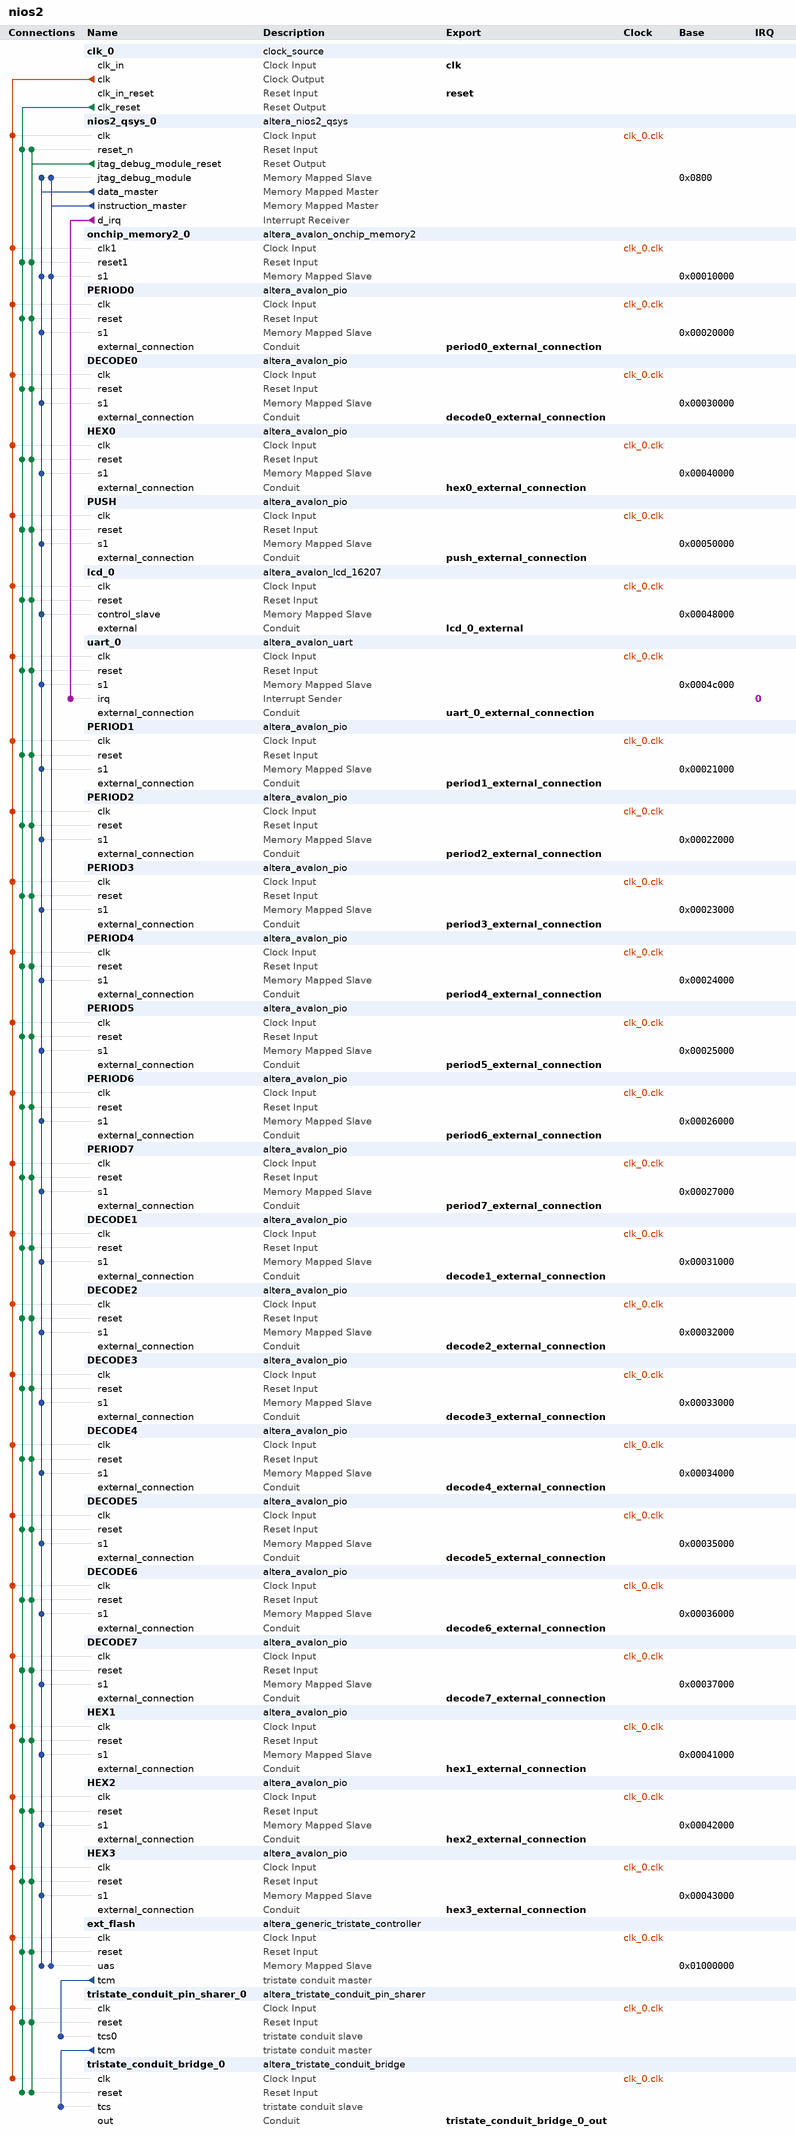
[diagram p0: system contents]
# Platform Designer (Qsys) system nios2, Cyclone II EP2C35F672C6
# Parameters at their usual value, and those the tool derives, are not listed.
package require -exact qsys 13.0.1.99.2
create_system nios2
set_project_property DEVICE_FAMILY {Cyclone II}
set_project_property DEVICE EP2C35F672C6

add_instance clk_0 clock_source 13.0
set_instance_parameter_value clk_0 clockFrequency 50000000

add_instance nios2_qsys_0 altera_nios2_qsys 13.0
set_instance_parameter_value nios2_qsys_0 resetSlave onchip_memory2_0.s1
set_instance_parameter_value nios2_qsys_0 mmu_TLBMissExcSlave None
set_instance_parameter_value nios2_qsys_0 exceptionSlave onchip_memory2_0.s1
set_instance_parameter_value nios2_qsys_0 breakSlave nios2_qsys_0.jtag_debug_module
set_instance_parameter_value nios2_qsys_0 impl Tiny
set_instance_parameter_value nios2_qsys_0 icache_size 4096

add_instance onchip_memory2_0 altera_avalon_onchip_memory2 13.0.1.99.2
set_instance_parameter_value onchip_memory2_0 dataWidth 32
set_instance_parameter_value onchip_memory2_0 dualPort false
set_instance_parameter_value onchip_memory2_0 initMemContent true
set_instance_parameter_value onchip_memory2_0 initializationFileName onchip_mem.hex
set_instance_parameter_value onchip_memory2_0 memorySize 16384

add_instance PERIOD0 altera_avalon_pio 13.0.1.99.2
set_instance_parameter_value PERIOD0 direction Output
set_instance_parameter_value PERIOD0 width 28

add_instance DECODE0 altera_avalon_pio 13.0.1.99.2
set_instance_parameter_value DECODE0 direction Output
set_instance_parameter_value DECODE0 width 28

add_instance HEX0 altera_avalon_pio 13.0.1.99.2
set_instance_parameter_value HEX0 direction Output
set_instance_parameter_value HEX0 width 8

add_instance PUSH altera_avalon_pio 13.0.1.99.2
set_instance_parameter_value PUSH direction Input
set_instance_parameter_value PUSH width 2

add_instance lcd_0 altera_avalon_lcd_16207 13.0.1.99.2

add_instance uart_0 altera_avalon_uart 13.0.1.99.2
set_instance_parameter_value uart_0 baud 115200
set_instance_parameter_value uart_0 dataBits 8
set_instance_parameter_value uart_0 fixedBaud true
set_instance_parameter_value uart_0 parity NONE
set_instance_parameter_value uart_0 stopBits 1

add_instance PERIOD1 altera_avalon_pio 13.0.1.99.2
set_instance_parameter_value PERIOD1 direction Output
set_instance_parameter_value PERIOD1 width 28

add_instance PERIOD2 altera_avalon_pio 13.0.1.99.2
set_instance_parameter_value PERIOD2 direction Output
set_instance_parameter_value PERIOD2 width 28

add_instance PERIOD3 altera_avalon_pio 13.0.1.99.2
set_instance_parameter_value PERIOD3 direction Output
set_instance_parameter_value PERIOD3 width 28

add_instance PERIOD4 altera_avalon_pio 13.0.1.99.2
set_instance_parameter_value PERIOD4 direction Output
set_instance_parameter_value PERIOD4 width 28

add_instance PERIOD5 altera_avalon_pio 13.0.1.99.2
set_instance_parameter_value PERIOD5 direction Output
set_instance_parameter_value PERIOD5 width 28

add_instance PERIOD6 altera_avalon_pio 13.0.1.99.2
set_instance_parameter_value PERIOD6 direction Output
set_instance_parameter_value PERIOD6 width 28

add_instance PERIOD7 altera_avalon_pio 13.0.1.99.2
set_instance_parameter_value PERIOD7 direction Output
set_instance_parameter_value PERIOD7 width 28

add_instance DECODE1 altera_avalon_pio 13.0.1.99.2
set_instance_parameter_value DECODE1 direction Output
set_instance_parameter_value DECODE1 width 28

add_instance DECODE2 altera_avalon_pio 13.0.1.99.2
set_instance_parameter_value DECODE2 direction Output
set_instance_parameter_value DECODE2 width 28

add_instance DECODE3 altera_avalon_pio 13.0.1.99.2
set_instance_parameter_value DECODE3 direction Output
set_instance_parameter_value DECODE3 width 28

add_instance DECODE4 altera_avalon_pio 13.0.1.99.2
set_instance_parameter_value DECODE4 direction Output
set_instance_parameter_value DECODE4 width 28

add_instance DECODE5 altera_avalon_pio 13.0.1.99.2
set_instance_parameter_value DECODE5 direction Output
set_instance_parameter_value DECODE5 width 28

add_instance DECODE6 altera_avalon_pio 13.0.1.99.2
set_instance_parameter_value DECODE6 direction Output
set_instance_parameter_value DECODE6 width 28

add_instance DECODE7 altera_avalon_pio 13.0.1.99.2
set_instance_parameter_value DECODE7 direction Output
set_instance_parameter_value DECODE7 width 28

add_instance HEX1 altera_avalon_pio 13.0.1.99.2
set_instance_parameter_value HEX1 direction Output
set_instance_parameter_value HEX1 width 8

add_instance HEX2 altera_avalon_pio 13.0.1.99.2
set_instance_parameter_value HEX2 direction Output
set_instance_parameter_value HEX2 width 8

add_instance HEX3 altera_avalon_pio 13.0.1.99.2
set_instance_parameter_value HEX3 direction Output
set_instance_parameter_value HEX3 width 8

add_instance ext_flash altera_generic_tristate_controller 13.0
set_instance_parameter_value ext_flash TCM_ADDRESS_W 22
set_instance_parameter_value ext_flash TCM_DATA_W 8
set_instance_parameter_value ext_flash TCM_BYTEENABLE_W 1
set_instance_parameter_value ext_flash TCM_READ_WAIT 100
set_instance_parameter_value ext_flash TCM_WRITE_WAIT 100
set_instance_parameter_value ext_flash TCM_SETUP_WAIT 50
set_instance_parameter_value ext_flash TCM_DATA_HOLD 50
set_instance_parameter_value ext_flash TCM_MAX_PENDING_READ_TRANSACTIONS 3
set_instance_parameter_value ext_flash TCM_TURNAROUND_TIME 2
set_instance_parameter_value ext_flash TCM_TIMING_UNITS 0
set_instance_parameter_value ext_flash TCM_READLATENCY 2
set_instance_parameter_value ext_flash TCM_SYMBOLS_PER_WORD 1
set_instance_parameter_value ext_flash USE_READ 1
set_instance_parameter_value ext_flash USE_BEGINTRANSFER 0
set_instance_parameter_value ext_flash USE_BYTEENABLE 0
set_instance_parameter_value ext_flash USE_OUTPUTENABLE 0
set_instance_parameter_value ext_flash ACTIVE_LOW_READ 1
set_instance_parameter_value ext_flash ACTIVE_LOW_BYTEENABLE 0
set_instance_parameter_value ext_flash ACTIVE_LOW_OUTPUTENABLE 0
set_instance_parameter_value ext_flash ACTIVE_LOW_BEGINTRANSFER 0
set_instance_parameter_value ext_flash CHIPSELECT_THROUGH_READLATENCY 0
set_instance_parameter_value ext_flash MODULE_ASSIGNMENT_KEYS embeddedsw.configuration.hwClassnameDriverSupportList,embeddedsw.configuration.hwClassnameDriverSupportDefault,embeddedsw.CMacro.SETUP_VALUE,embeddedsw.CMacro.WAIT_VALUE,embeddedsw.CMacro.HOLD_VALUE,embeddedsw.CMacro.TIMING_UNITS,embeddedsw.CMacro.SIZE,embeddedsw.memoryInfo.MEM_INIT_DATA_WIDTH,embeddedsw.memoryInfo.HAS_BYTE_LANE,embeddedsw.memoryInfo.IS_FLASH,embeddedsw.memoryInfo.GENERATE_DAT_SYM,embeddedsw.memoryInfo.GENERATE_FLASH,embeddedsw.memoryInfo.DAT_SYM_INSTALL_DIR,embeddedsw.memoryInfo.FLASH_INSTALL_DIR
set_instance_parameter_value ext_flash MODULE_ASSIGNMENT_VALUES altera_avalon_lan91c111:altera_avalon_cfi_flash,altera_avalon_cfi_flash,0,0,0,ns,262144u,8,0,1,1,1,SIM_DIR,APP_DIR
set_instance_parameter_value ext_flash INTERFACE_ASSIGNMENT_KEYS embeddedsw.configuration.isFlash,embeddedsw.configuration.isMemoryDevice,embeddedsw.configuration.isNonVolatileStorage
set_instance_parameter_value ext_flash INTERFACE_ASSIGNMENT_VALUES 1,1,1

add_instance tristate_conduit_pin_sharer_0 altera_tristate_conduit_pin_sharer 13.0
set_instance_parameter_value tristate_conduit_pin_sharer_0 NUM_INTERFACES 1

add_instance tristate_conduit_bridge_0 altera_tristate_conduit_bridge 13.0

# connections
add_connection clk_0.clk DECODE0.clk clock
add_connection clk_0.clk DECODE1.clk clock
add_connection clk_0.clk DECODE2.clk clock
add_connection clk_0.clk DECODE3.clk clock
add_connection clk_0.clk DECODE4.clk clock
add_connection clk_0.clk DECODE5.clk clock
add_connection clk_0.clk DECODE6.clk clock
add_connection clk_0.clk DECODE7.clk clock
add_connection clk_0.clk ext_flash.clk clock
add_connection clk_0.clk HEX0.clk clock
add_connection clk_0.clk HEX1.clk clock
add_connection clk_0.clk HEX2.clk clock
add_connection clk_0.clk HEX3.clk clock
add_connection clk_0.clk lcd_0.clk clock
add_connection clk_0.clk nios2_qsys_0.clk clock
add_connection clk_0.clk onchip_memory2_0.clk1 clock
add_connection clk_0.clk PERIOD0.clk clock
add_connection clk_0.clk PERIOD1.clk clock
add_connection clk_0.clk PERIOD2.clk clock
add_connection clk_0.clk PERIOD3.clk clock
add_connection clk_0.clk PERIOD4.clk clock
add_connection clk_0.clk PERIOD5.clk clock
add_connection clk_0.clk PERIOD6.clk clock
add_connection clk_0.clk PERIOD7.clk clock
add_connection clk_0.clk PUSH.clk clock
add_connection clk_0.clk tristate_conduit_bridge_0.clk clock
add_connection clk_0.clk tristate_conduit_pin_sharer_0.clk clock
add_connection clk_0.clk uart_0.clk clock
add_connection clk_0.clk_reset DECODE0.reset reset
add_connection clk_0.clk_reset DECODE1.reset reset
add_connection clk_0.clk_reset DECODE2.reset reset
add_connection clk_0.clk_reset DECODE3.reset reset
add_connection clk_0.clk_reset DECODE4.reset reset
add_connection clk_0.clk_reset DECODE5.reset reset
add_connection clk_0.clk_reset DECODE6.reset reset
add_connection clk_0.clk_reset DECODE7.reset reset
add_connection clk_0.clk_reset ext_flash.reset reset
add_connection clk_0.clk_reset HEX0.reset reset
add_connection clk_0.clk_reset HEX1.reset reset
add_connection clk_0.clk_reset HEX2.reset reset
add_connection clk_0.clk_reset HEX3.reset reset
add_connection clk_0.clk_reset lcd_0.reset reset
add_connection clk_0.clk_reset nios2_qsys_0.reset_n reset
add_connection clk_0.clk_reset onchip_memory2_0.reset1 reset
add_connection clk_0.clk_reset PERIOD0.reset reset
add_connection clk_0.clk_reset PERIOD1.reset reset
add_connection clk_0.clk_reset PERIOD2.reset reset
add_connection clk_0.clk_reset PERIOD3.reset reset
add_connection clk_0.clk_reset PERIOD4.reset reset
add_connection clk_0.clk_reset PERIOD5.reset reset
add_connection clk_0.clk_reset PERIOD6.reset reset
add_connection clk_0.clk_reset PERIOD7.reset reset
add_connection clk_0.clk_reset PUSH.reset reset
add_connection clk_0.clk_reset tristate_conduit_bridge_0.reset reset
add_connection clk_0.clk_reset tristate_conduit_pin_sharer_0.reset reset
add_connection clk_0.clk_reset uart_0.reset reset
add_connection nios2_qsys_0.jtag_debug_module_reset DECODE0.reset reset
add_connection nios2_qsys_0.jtag_debug_module_reset DECODE1.reset reset
add_connection nios2_qsys_0.jtag_debug_module_reset DECODE2.reset reset
add_connection nios2_qsys_0.jtag_debug_module_reset DECODE3.reset reset
add_connection nios2_qsys_0.jtag_debug_module_reset DECODE4.reset reset
add_connection nios2_qsys_0.jtag_debug_module_reset DECODE5.reset reset
add_connection nios2_qsys_0.jtag_debug_module_reset DECODE6.reset reset
add_connection nios2_qsys_0.jtag_debug_module_reset DECODE7.reset reset
add_connection nios2_qsys_0.jtag_debug_module_reset ext_flash.reset reset
add_connection nios2_qsys_0.jtag_debug_module_reset HEX0.reset reset
add_connection nios2_qsys_0.jtag_debug_module_reset HEX1.reset reset
add_connection nios2_qsys_0.jtag_debug_module_reset HEX2.reset reset
add_connection nios2_qsys_0.jtag_debug_module_reset HEX3.reset reset
add_connection nios2_qsys_0.jtag_debug_module_reset lcd_0.reset reset
add_connection nios2_qsys_0.jtag_debug_module_reset nios2_qsys_0.reset_n reset
add_connection nios2_qsys_0.jtag_debug_module_reset onchip_memory2_0.reset1 reset
add_connection nios2_qsys_0.jtag_debug_module_reset PERIOD0.reset reset
add_connection nios2_qsys_0.jtag_debug_module_reset PERIOD1.reset reset
add_connection nios2_qsys_0.jtag_debug_module_reset PERIOD2.reset reset
add_connection nios2_qsys_0.jtag_debug_module_reset PERIOD3.reset reset
add_connection nios2_qsys_0.jtag_debug_module_reset PERIOD4.reset reset
add_connection nios2_qsys_0.jtag_debug_module_reset PERIOD5.reset reset
add_connection nios2_qsys_0.jtag_debug_module_reset PERIOD6.reset reset
add_connection nios2_qsys_0.jtag_debug_module_reset PERIOD7.reset reset
add_connection nios2_qsys_0.jtag_debug_module_reset PUSH.reset reset
add_connection nios2_qsys_0.jtag_debug_module_reset tristate_conduit_bridge_0.reset reset
add_connection nios2_qsys_0.jtag_debug_module_reset tristate_conduit_pin_sharer_0.reset reset
add_connection nios2_qsys_0.jtag_debug_module_reset uart_0.reset reset
add_connection nios2_qsys_0.data_master DECODE0.s1 avalon
set_connection_parameter_value nios2_qsys_0.data_master/DECODE0.s1 baseAddress 0x00030000
add_connection nios2_qsys_0.data_master DECODE1.s1 avalon
set_connection_parameter_value nios2_qsys_0.data_master/DECODE1.s1 baseAddress 0x00031000
add_connection nios2_qsys_0.data_master DECODE2.s1 avalon
set_connection_parameter_value nios2_qsys_0.data_master/DECODE2.s1 baseAddress 0x00032000
add_connection nios2_qsys_0.data_master DECODE3.s1 avalon
set_connection_parameter_value nios2_qsys_0.data_master/DECODE3.s1 baseAddress 0x00033000
add_connection nios2_qsys_0.data_master DECODE4.s1 avalon
set_connection_parameter_value nios2_qsys_0.data_master/DECODE4.s1 baseAddress 0x00034000
add_connection nios2_qsys_0.data_master DECODE5.s1 avalon
set_connection_parameter_value nios2_qsys_0.data_master/DECODE5.s1 baseAddress 0x00035000
add_connection nios2_qsys_0.data_master DECODE6.s1 avalon
set_connection_parameter_value nios2_qsys_0.data_master/DECODE6.s1 baseAddress 0x00036000
add_connection nios2_qsys_0.data_master DECODE7.s1 avalon
set_connection_parameter_value nios2_qsys_0.data_master/DECODE7.s1 baseAddress 0x00037000
add_connection nios2_qsys_0.data_master ext_flash.uas avalon
set_connection_parameter_value nios2_qsys_0.data_master/ext_flash.uas baseAddress 0x01000000
add_connection nios2_qsys_0.data_master HEX0.s1 avalon
set_connection_parameter_value nios2_qsys_0.data_master/HEX0.s1 baseAddress 0x00040000
add_connection nios2_qsys_0.data_master HEX1.s1 avalon
set_connection_parameter_value nios2_qsys_0.data_master/HEX1.s1 baseAddress 0x00041000
add_connection nios2_qsys_0.data_master HEX2.s1 avalon
set_connection_parameter_value nios2_qsys_0.data_master/HEX2.s1 baseAddress 0x00042000
add_connection nios2_qsys_0.data_master HEX3.s1 avalon
set_connection_parameter_value nios2_qsys_0.data_master/HEX3.s1 baseAddress 0x00043000
add_connection nios2_qsys_0.data_master lcd_0.control_slave avalon
set_connection_parameter_value nios2_qsys_0.data_master/lcd_0.control_slave baseAddress 0x00048000
add_connection nios2_qsys_0.data_master nios2_qsys_0.jtag_debug_module avalon
set_connection_parameter_value nios2_qsys_0.data_master/nios2_qsys_0.jtag_debug_module baseAddress 0x0800
add_connection nios2_qsys_0.data_master onchip_memory2_0.s1 avalon
set_connection_parameter_value nios2_qsys_0.data_master/onchip_memory2_0.s1 baseAddress 0x00010000
add_connection nios2_qsys_0.data_master PERIOD0.s1 avalon
set_connection_parameter_value nios2_qsys_0.data_master/PERIOD0.s1 baseAddress 0x00020000
add_connection nios2_qsys_0.data_master PERIOD1.s1 avalon
set_connection_parameter_value nios2_qsys_0.data_master/PERIOD1.s1 baseAddress 0x00021000
add_connection nios2_qsys_0.data_master PERIOD2.s1 avalon
set_connection_parameter_value nios2_qsys_0.data_master/PERIOD2.s1 baseAddress 0x00022000
add_connection nios2_qsys_0.data_master PERIOD3.s1 avalon
set_connection_parameter_value nios2_qsys_0.data_master/PERIOD3.s1 baseAddress 0x00023000
add_connection nios2_qsys_0.data_master PERIOD4.s1 avalon
set_connection_parameter_value nios2_qsys_0.data_master/PERIOD4.s1 baseAddress 0x00024000
add_connection nios2_qsys_0.data_master PERIOD5.s1 avalon
set_connection_parameter_value nios2_qsys_0.data_master/PERIOD5.s1 baseAddress 0x00025000
add_connection nios2_qsys_0.data_master PERIOD6.s1 avalon
set_connection_parameter_value nios2_qsys_0.data_master/PERIOD6.s1 baseAddress 0x00026000
add_connection nios2_qsys_0.data_master PERIOD7.s1 avalon
set_connection_parameter_value nios2_qsys_0.data_master/PERIOD7.s1 baseAddress 0x00027000
add_connection nios2_qsys_0.data_master PUSH.s1 avalon
set_connection_parameter_value nios2_qsys_0.data_master/PUSH.s1 baseAddress 0x00050000
add_connection nios2_qsys_0.data_master uart_0.s1 avalon
set_connection_parameter_value nios2_qsys_0.data_master/uart_0.s1 baseAddress 0x0004c000
add_connection nios2_qsys_0.instruction_master ext_flash.uas avalon
set_connection_parameter_value nios2_qsys_0.instruction_master/ext_flash.uas baseAddress 0x01000000
add_connection nios2_qsys_0.instruction_master nios2_qsys_0.jtag_debug_module avalon
set_connection_parameter_value nios2_qsys_0.instruction_master/nios2_qsys_0.jtag_debug_module baseAddress 0x0800
add_connection nios2_qsys_0.instruction_master onchip_memory2_0.s1 avalon
set_connection_parameter_value nios2_qsys_0.instruction_master/onchip_memory2_0.s1 baseAddress 0x00010000
add_connection nios2_qsys_0.d_irq uart_0.irq interrupt
set_connection_parameter_value nios2_qsys_0.d_irq/uart_0.irq irqNumber 0
add_connection ext_flash.tcm tristate_conduit_pin_sharer_0.tcs0 tristate_conduit
add_connection tristate_conduit_pin_sharer_0.tcm tristate_conduit_bridge_0.tcs tristate_conduit

# exported interfaces
add_interface clk clock sink
set_interface_property clk EXPORT_OF clk_0.clk_in
add_interface reset reset sink
set_interface_property reset EXPORT_OF clk_0.clk_in_reset
add_interface period0_external_connection conduit end
set_interface_property period0_external_connection EXPORT_OF PERIOD0.external_connection
add_interface decode0_external_connection conduit end
set_interface_property decode0_external_connection EXPORT_OF DECODE0.external_connection
add_interface hex0_external_connection conduit end
set_interface_property hex0_external_connection EXPORT_OF HEX0.external_connection
add_interface push_external_connection conduit end
set_interface_property push_external_connection EXPORT_OF PUSH.external_connection
add_interface lcd_0_external conduit end
set_interface_property lcd_0_external EXPORT_OF lcd_0.external
add_interface uart_0_external_connection conduit end
set_interface_property uart_0_external_connection EXPORT_OF uart_0.external_connection
add_interface period1_external_connection conduit end
set_interface_property period1_external_connection EXPORT_OF PERIOD1.external_connection
add_interface period2_external_connection conduit end
set_interface_property period2_external_connection EXPORT_OF PERIOD2.external_connection
add_interface period3_external_connection conduit end
set_interface_property period3_external_connection EXPORT_OF PERIOD3.external_connection
add_interface period4_external_connection conduit end
set_interface_property period4_external_connection EXPORT_OF PERIOD4.external_connection
add_interface period5_external_connection conduit end
set_interface_property period5_external_connection EXPORT_OF PERIOD5.external_connection
add_interface period6_external_connection conduit end
set_interface_property period6_external_connection EXPORT_OF PERIOD6.external_connection
add_interface period7_external_connection conduit end
set_interface_property period7_external_connection EXPORT_OF PERIOD7.external_connection
add_interface decode1_external_connection conduit end
set_interface_property decode1_external_connection EXPORT_OF DECODE1.external_connection
add_interface decode2_external_connection conduit end
set_interface_property decode2_external_connection EXPORT_OF DECODE2.external_connection
add_interface decode3_external_connection conduit end
set_interface_property decode3_external_connection EXPORT_OF DECODE3.external_connection
add_interface decode4_external_connection conduit end
set_interface_property decode4_external_connection EXPORT_OF DECODE4.external_connection
add_interface decode5_external_connection conduit end
set_interface_property decode5_external_connection EXPORT_OF DECODE5.external_connection
add_interface decode6_external_connection conduit end
set_interface_property decode6_external_connection EXPORT_OF DECODE6.external_connection
add_interface decode7_external_connection conduit end
set_interface_property decode7_external_connection EXPORT_OF DECODE7.external_connection
add_interface hex1_external_connection conduit end
set_interface_property hex1_external_connection EXPORT_OF HEX1.external_connection
add_interface hex2_external_connection conduit end
set_interface_property hex2_external_connection EXPORT_OF HEX2.external_connection
add_interface hex3_external_connection conduit end
set_interface_property hex3_external_connection EXPORT_OF HEX3.external_connection
add_interface tristate_conduit_bridge_0_out conduit end
set_interface_property tristate_conduit_bridge_0_out EXPORT_OF tristate_conduit_bridge_0.out

set_interconnect_requirement {$system} qsys_mm.clockCrossingAdapter HANDSHAKE
set_interconnect_requirement {$system} qsys_mm.maxAdditionalLatency 1

save_system nios2.qsys
